# EasyEDA Pro project Restaurant table pager circular.epro, schematic Schematic4
Board Name: Board4; Create Date: 2025-12-18; Page Name: P1; Project Name: Restaurant Table Pager Circular; Schematic Name: Schematic4; Update Date: 2026-02-03; Company: EasyEDA.com; Page Size: A4; Version: V1.0
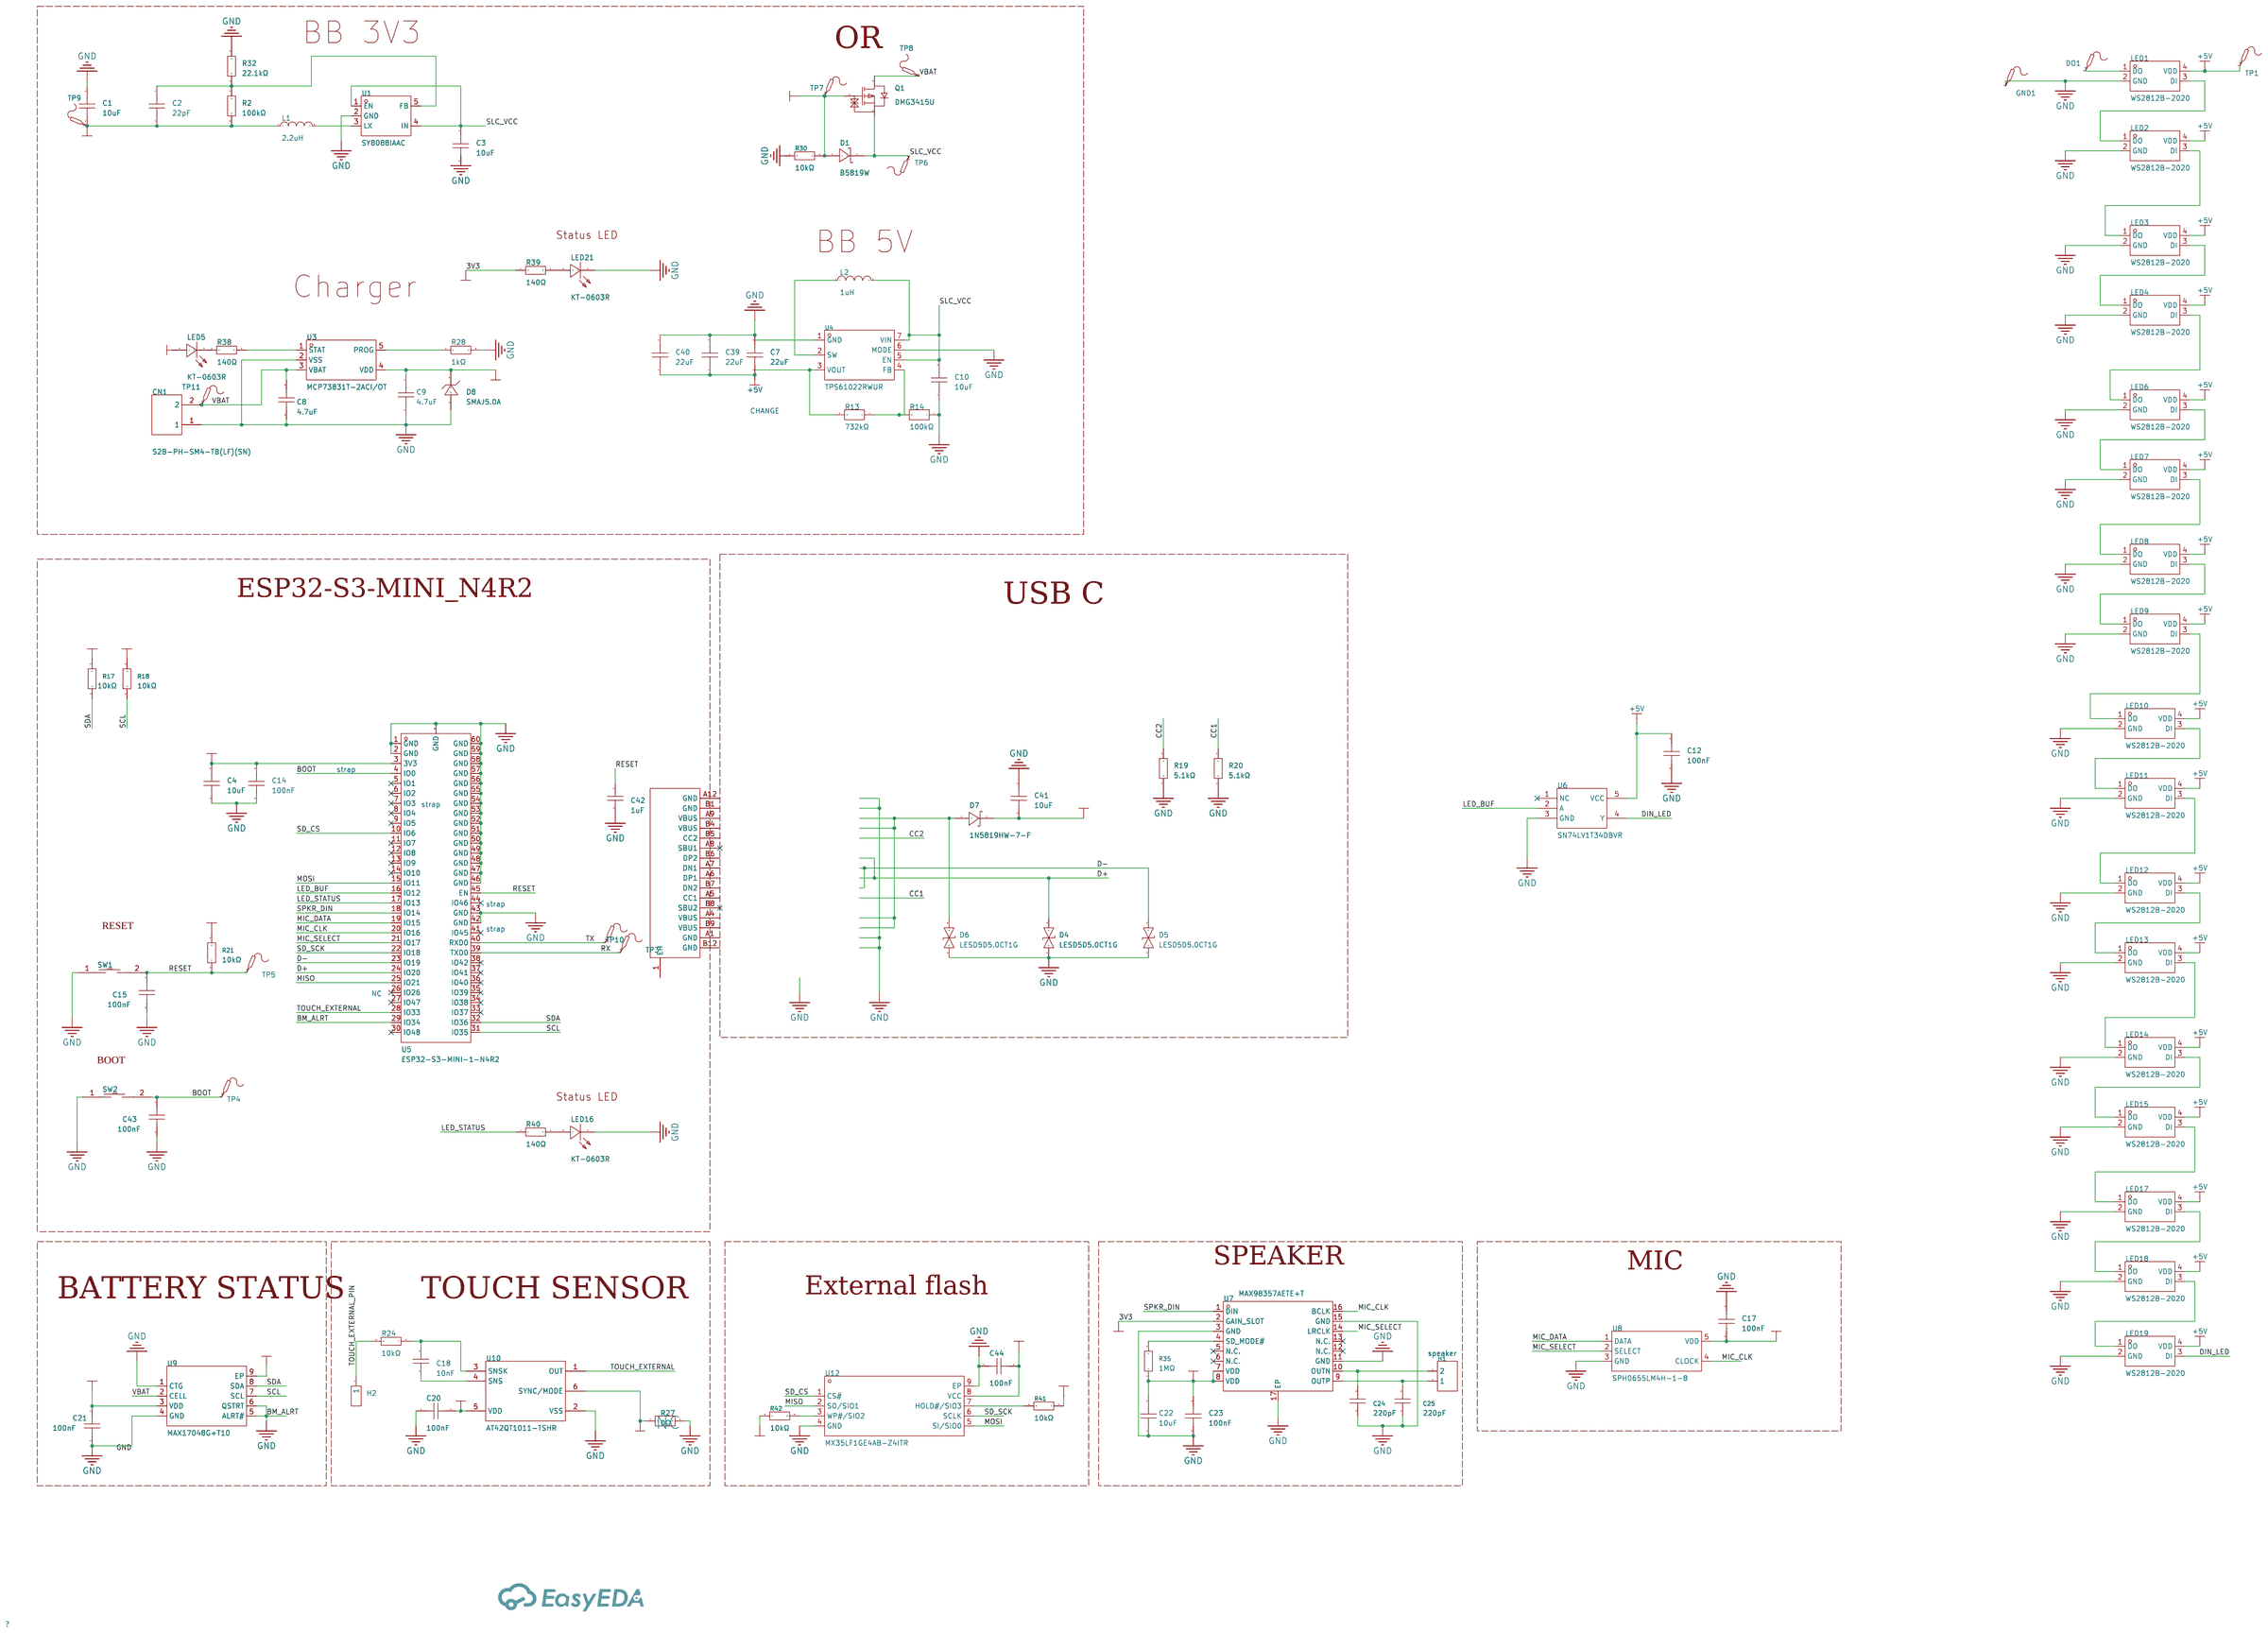
[diagram p0: schematic sheet]

## Parts
C1  10uF  [CAP-SMD_L3.2-W1.6]
C2  22pF  [C0603]
C3  10uF  [CAP-SMD_L3.2-W1.6]
C4  10uF  [C0402]
C7  22uF  [C0402]
C8  4.7uF  [C0402]
C9  4.7uF  [C0402]
C10  10uF  [C0402]
C12  100nF  [C0402]
C14  100nF  [C0402]
C15  100nF  [C0402]
C17  100nF  [C0402]
C18  10nF  [C0402]
C20  100nF  [C0402]
C21  100nF  [C0402]
C22  10uF  [C0402]
C23  100nF  [C0402]
C24  220pF  [C0402]
C25  220pF  [C0402]
C39  22uF  [C0402]
C40  22uF  [C0402]
C41  10uF  [C0402]
C42  1uF  [C0402]
C43  100nF  [C0402]
C44  100nF  [C0402]
CN1  S2B-PH-SM4-TB(LF)(SN)  [CONN-SMD_P2.00_S2B-PH-SM4-TB-LF-SN]
D1  B5819W  [SOD-123_L2.8-W1.8-LS3.7-RD]
D4  LESD5D5.0CT1G  [SOD-523_L1.2-W0.8-LS1.6-BI]
D5  LESD5D5.0CT1G  [SOD-523_L1.2-W0.8-LS1.6-BI]
D6  LESD5D5.0CT1G  [SOD-523_L1.2-W0.8-LS1.6-BI]
D7  1N5819HW-7-F  [SOD-123_L2.7-W1.6-LS3.7-RD]
D8  SMAJ5.0A  [SMA_L4.3-W2.6-LS5.1-RD]
DO1  -  [Test-Point-0.5mm]
GND1  -  [Test-Point-0.5mm]
H1  speaker  [CONN-SMD_P2.00_S2B-PH-SM4-TB-LF-SN]
H2  -  [HDR-TH_1P-V-M_XKB_X4611WV-01I-C28D40]  (no BOM)
L1  2.2uH  [IND-SMD_L2.5-W2.0_MHCHL2520]
L2  1uH  [IND-SMD_L5.4-W5.1]
LED1  WS2812B-2020  [LED-SMD_4P-L2.0-W2.0-TL_WS2812B-2020]
LED2  WS2812B-2020  [LED-SMD_4P-L2.0-W2.0-TL_WS2812B-2020]
LED3  WS2812B-2020  [LED-SMD_4P-L2.0-W2.0-TL_WS2812B-2020]
LED4  WS2812B-2020  [LED-SMD_4P-L2.0-W2.0-TL_WS2812B-2020]
LED5  KT-0603R  [LED0603-RD]
LED6  WS2812B-2020  [LED-SMD_4P-L2.0-W2.0-TL_WS2812B-2020]
LED7  WS2812B-2020  [LED-SMD_4P-L2.0-W2.0-TL_WS2812B-2020]
LED8  WS2812B-2020  [LED-SMD_4P-L2.0-W2.0-TL_WS2812B-2020]
LED9  WS2812B-2020  [LED-SMD_4P-L2.0-W2.0-TL_WS2812B-2020]
LED10  WS2812B-2020  [LED-SMD_4P-L2.0-W2.0-TL_WS2812B-2020]
LED11  WS2812B-2020  [LED-SMD_4P-L2.0-W2.0-TL_WS2812B-2020]
LED12  WS2812B-2020  [LED-SMD_4P-L2.0-W2.0-TL_WS2812B-2020]
LED13  WS2812B-2020  [LED-SMD_4P-L2.0-W2.0-TL_WS2812B-2020]
LED14  WS2812B-2020  [LED-SMD_4P-L2.0-W2.0-TL_WS2812B-2020]
LED15  WS2812B-2020  [LED-SMD_4P-L2.0-W2.0-TL_WS2812B-2020]
LED16  KT-0603R  [LED0603-RD]
LED17  WS2812B-2020  [LED-SMD_4P-L2.0-W2.0-TL_WS2812B-2020]
LED18  WS2812B-2020  [LED-SMD_4P-L2.0-W2.0-TL_WS2812B-2020]
LED19  WS2812B-2020  [LED-SMD_4P-L2.0-W2.0-TL_WS2812B-2020]
LED21  KT-0603R  [LED0603-RD]
Q1  DMG3415U  [SOT-23-3_L2.9-W1.3-P1.90-LS2.4-BR-1]
R2  100kΩ  [R0402]
R13  732kΩ  [R0402]
R14  100kΩ  [R0402]
R17  10kΩ  [R0402]
R18  10kΩ  [R0402]
R19  5.1kΩ  [R0402]
R20  5.1kΩ  [R0402]
R21  10kΩ  [R0402]
R24  10kΩ  [R0402]
R27  0Ω  [R0402]
R28  1kΩ  [R0402]
R30  10kΩ  [R0402]
R32  22.1kΩ  [R0402]
R35  1MΩ  [R0402]
R38  140Ω  [R0402]
R39  140Ω  [R0402]
R40  140Ω  [R0402]
R41  10kΩ  [R0402]
R42  10kΩ  [R0402]
SW1  B3U-1000P  [KEY-SMD_B3U-1000PM]
SW2  B3U-1000P  [KEY-SMD_B3U-1000PM]
TP1  -  [Test-Point-0.5mm]
TP3  -  [Test-Point-0.5mm]
TP4  -  [Test-Point-0.5mm]
TP5  -  [Test-Point-0.5mm]
TP6  -  [Test-Point-0.5mm]
TP7  -  [Test-Point-0.5mm]
TP8  -  [Test-Point-0.5mm]
TP9  -  [Test-Point-0.5mm]
TP10  -  [Test-Point-0.5mm]
TP11  -  [Test-Point-0.5mm]
U1  SY8088IAAC  [SOT-23-5_L3.0-W1.7-P0.95-LS2.8-BL]
U3  MCP73831T-2ACI/OT  [SOT-23-5_L3.0-W1.7-P0.95-LS2.8-BL]
U4  TPS61022RWUR  [VQFN-7_L2.0-W2.0-P0.55-TL_RWU]
U5  ESP32-S3-MINI-1-N4R2  [BULETM-SMD_ESP32-S3-MINI-1-N8]
U6  SN74LV1T34DBVR  [SOT-23-5_L2.9-W1.6-P0.95-LS2.8-BR_2]
U7  MAX98357AETE+T  [TQFN-16_L3.0-W3.0-P0.50-BL-EP1.5]
U8  SPH0655LM4H-1-8  [MIC-SMD_SPH0655LM4H-1-8]
U9  MAX17048G+T10  [TDFN-8_L2.0-W2.0-P0.50-BL-EP1.2]
U10  AT42QT1011-TSHR  [SOT-23-6_L2.9-W1.6-P0.95-LS2.8-BR]
U12  MX35LF1GE4AB-Z4ITR  [WSON-8_L8.0-W6.0-P1.27-TL-1]
USB1  USB4105-GF-A  [TYPE-C-SMD_SBC-160S1A-20-S412]

## Library data of the parts
C1 C3 = CA45-A-16V-10uF-K_C185774: Capacitance:10uF Tolerance:±10% Tolerance:±10% Voltage Rating:16V Equivalent Series Resistance(ESR):2Ω@100kHz Operating Temperature:-55℃~+125℃ Operating Temperature:-55℃~+125℃; LCSC Part Name: 10uF ±10% 16V; Supplier Part: C185774; Manufacturer: TORCH(火炬); Manufacturer Part: CA45-A-16V-10uF-K; Supplier Footprint: CASE-A-3216-16(mm); JLCPCB Part Class: Extended Part; Datasheet: https://item.szlcsc.com/datasheet/CA45-A-16V-10uF-K/197179.html; Supplier: LCSC; Tolerance: ±10%; Voltage Rating: 16V; Equivalent Series Resistance(ESR): 2Ω@100kHz; Operating Temperature: -55℃~+125℃
C2 = AC0603JRNPO9BN220: Capacitance: Tolerance:±5% Tolerance:±5% Voltage Rated: Temperature Coefficient:; LCSC Part Name: 22pF ±5% 50V; Supplier Part: C309441; Manufacturer: YAGEO(国巨); Supplier Footprint: 0603; JLCPCB Part Class: Extended Part; Datasheet: https://atta.szlcsc.com/upload/public/pdf/source/20181008/C309442_A87E4BF7F83363A5173AA98FD3D817F0.pdf; Supplier: LCSC; Tolerance: ±5%
C4 C10 C22 C41 = 0402ZD106MAT2A: Capacitance:10uF Tolerance:±20% Tolerance:±20% Voltage Rating:10V Temperature Coefficient:X5R; LCSC Part Name: 10uF ±20% 10V; Supplier Part: C2167902; Manufacturer: Kyocera AVX; Supplier Footprint: 0402; JLCPCB Part Class: Extended Part; Supplier: LCSC; Tolerance: ±20%; Voltage Rating: 10V; Temperature Coefficient: X5R
C7 C39 C40 = 04026D226MAT2A: Capacitance:22uF Tolerance:±20% Tolerance:±20% Voltage Rating:6.3V Temperature Coefficient:X5R; LCSC Part Name: 22uF ±20% 6.3V; Supplier Part: C2179118; Manufacturer: Kyocera AVX; Supplier Footprint: 0402; JLCPCB Part Class: Extended Part; Supplier: LCSC; Tolerance: ±20%; Voltage Rating: 6.3V; Temperature Coefficient: X5R
C8 C9 = 0402X475K100NT: Capacitance:4.7uF Tolerance:±10% Tolerance:±10% Voltage Rating:10V Temperature Coefficient:X5R; LCSC Part Name: 4.7uF ±10% 10V; Supplier Part: C191541; Manufacturer: FH(风华); Supplier Footprint: 0402; JLCPCB Part Class: Extended Part; Datasheet: https://atta.szlcsc.com/upload/public/pdf/source/20231013/50987BFA113EBC42343E989A0A057269.pdf; Supplier: LCSC; Tolerance: ±10%; Voltage Rating: 10V; Temperature Coefficient: X5R
C12 = CL05B104KO5NNNC: Capacitance:100nF Tolerance:±10% Tolerance:±10% Voltage Rating:16V Temperature Coefficient:X7R; LCSC Part Name: 100nF ±10% 16V; Supplier Part: C1525; Manufacturer: SAMSUNG(三星); Supplier Footprint: 0402; JLCPCB Part Class: Basic Part; Datasheet: https://item.szlcsc.com/datasheet/CL05B104KO5NNNC/1877.html; Supplier: LCSC; Tolerance: ±10%; Voltage Rating: 16V; Temperature Coefficient: X7R
C14 C15 C20 C21 C23 C43 = CL05B104KB54PNC: Capacitance:100nF Tolerance:±10% Tolerance:±10% Voltage Rating:50V Temperature Coefficient:X7R; LCSC Part Name: 100nF ±10% 50V; Supplier Part: C307331; Manufacturer: SAMSUNG(三星); Supplier Footprint: 0402; JLCPCB Part Class: Basic Part; Datasheet: https://item.szlcsc.com/datasheet/CL05B104KB54PNC/291005.html; Supplier: LCSC; Tolerance: ±10%; Voltage Rating: 50V; Temperature Coefficient: X7R
C17 C44 = CT41G-0402-2X1-16V-0.1uF-K(N): Capacitance:100nF Tolerance:±10% Tolerance:±10% Voltage Rating:16V Temperature Coefficient:-; LCSC Part Name: 100nF ±10% 16V; Supplier Part: C141382; Manufacturer: TORCH(火炬); Supplier Footprint: 0402; JLCPCB Part Class: Extended Part; Datasheet: https://item.szlcsc.com/datasheet/CT41G-0402-2X1-16V-0.1uF-K(N)/152712.html; Supplier: LCSC; Tolerance: ±10%; Voltage Rating: 16V
C18 = CL05B103KB5NNNC: Capacitance: Tolerance:±10% Tolerance:±10% Voltage Rated: Temperature Coefficient:; LCSC Part Name: 10nF ±10% 50V; Supplier Part: C15195; Manufacturer: SAMSUNG(三星); Supplier Footprint: 0402; JLCPCB Part Class: Basic Part; Datasheet: https://atta.szlcsc.com/upload/public/pdf/source/20160218/1457707763339.pdf; Supplier: LCSC; Tolerance: ±10%
C24 C25 = 0402N221G500CT: Capacitance: Tolerance:±2% Tolerance:±2% Voltage Rated: Temperature Coefficient:; LCSC Part Name: 220pF ±2% 50V; Supplier Part: C458858; Manufacturer: Walsin(华新科); Supplier Footprint: 0402; JLCPCB Part Class: Extended Part; Datasheet: https://atta.szlcsc.com/upload/public/pdf/source/20191217/C469650_84AD5C6F618CF4AC0C6D987F2E8FE6F8.pdf; Supplier: LCSC; Tolerance: ±2%
C42 = CL05A105KP5NNNC: Capacitance:1uF Tolerance:±10% Tolerance:±10% Voltage Rating:10V Temperature Coefficient:X5R; LCSC Part Name: 1uF ±10% 10V; Supplier Part: C14445; Manufacturer: SAMSUNG(三星); Supplier Footprint: 0402; JLCPCB Part Class: Extended Part; Datasheet: https://item.szlcsc.com/datasheet/CL05A105KP5NNNC/15107.html; Supplier: LCSC; Tolerance: ±10%; Voltage Rating: 10V; Temperature Coefficient: X5R
CN1 H1 = S2B-PH-SM4-TB(LF)(SN): Pins Structure:1x2P Pitch:2mm Mounting Style:Horizontal attachment Reference Series:PH Number of Pins:2P Number of Rows:1 Number of PINs Per Row:2 Row Spacing:- Current Rating (Max):2A Contact Material:Copper alloy Contact Plating:Tin Operating Temperatur; LCSC Part Name: 1x2P 间距:2mm 卧贴 系列:PH; Supplier Part: C295747; Manufacturer: JST; Supplier Footprint: SMD,P=2mm,卧贴; JLCPCB Part Class: Extended Part; Datasheet: https://atta.szlcsc.com/upload/public/pdf/source/20210203/C295747_344B2E64535E381E727D98C302AB61C7.pdf; Supplier: LCSC; Pins Structure: 1x2P; Pitch: 2mm; Mounting Style: Horizontal attachment; Reference Series: PH; Number of Pins: 2P; Number of Rows: 1; Number of PINs Per Row: 2; Current Rating (Max): 2A; Contact Material: Copper alloy; Contact Plating: Tin; Operating Temperature Range: -25℃~+85℃; Rated Voltage (Max): 100V; Plastic Material: PA; Flame Retardant Rating: UL94V-0; Supplementary Features: Auxiliary soldering legs; Colour: Beige; Z-Height of the Board: 5.5mm; X-Length of Bottom Edge on Board (Spacing Line): 7.9mm; Y-Width of Bottom Edge on Board: 8.6mm
D1 = B5819W_C64885: Diode Configuration:Independent Voltage - Forward(Vf@If):900mV@3A Voltage - DC Reverse(Vr):40V Current - Rectified:1A Reverse Leakage Current (Ir):1mA@40V Operating Junction Temperature Range:-55℃~+125℃ Operating Junction Temperature Range:-55℃~+125℃ Non-; LCSC Part Name: 丝印SL 电压:40V 电流:1A; Supplier Part: C64885; Manufacturer: MDD(辰达半导体); Supplier Footprint: SOD-123; JLCPCB Part Class: Extended Part; Datasheet: https://item.szlcsc.com/datasheet/B5819W/65955.html; Supplier: LCSC; Diode Configuration: Independent; Voltage - Forward(Vf@If): 900mV@3A; Voltage - DC Reverse(Vr): 40V; Current - Rectified: 1A; Reverse Leakage Current (Ir): 1mA@40V; Operating Junction Temperature Range: -55℃~+125℃; Non-Repetitive Peak Forward Surge Current: 25A
D4-D6 = LESD5D5.0CT1G_C41399463: Polarity:Bidirectional Reverse Stand-Off Voltage (Vrwm):5V Clamping Voltage:16V Peak Pulse Current (Ipp):7A Peak Pulse Power Dissipation (Ppp):100W Voltage - Breakdown:7V Reverse Leakage Current (Ir):1uA Operating Temperature:-55℃~+150℃@(Tj) Operating Tem; LCSC Part Name: 双向ESD 5V截止 峰值脉冲电流：7A; Supplier Part: C41399463; Manufacturer: GOODWORK(固得沃克); Supplier Footprint: SOD-523; JLCPCB Part Class: Extended Part; Datasheet: https://item.szlcsc.com/datasheet/LESD5D5.0CT1G/43196790.html; Supplier: LCSC; Polarity: Bidirectional; Reverse Stand-Off Voltage (Vrwm): 5V; Clamping Voltage: 16V; Peak Pulse Current (Ipp): 7A; Peak Pulse Power Dissipation (Ppp): 100W; Voltage - Breakdown: 7V; Reverse Leakage Current (Ir): 1uA; Operating Temperature: -55℃~+150℃@(Tj); level of protection: IEC 61000-4-2; Type: ESD; Junction Capacitance: 12pF
D7 = 1N5819HW-7-F: Diode Configuration:1 Independent Voltage - Forward(Vf@If):450mV@1A Voltage - DC Reverse(Vr):40V Current - Rectified:1A Reverse Leakage Current (Ir):1mA@40V Operating Junction Temperature Range:-65℃~+150℃ Operating Junction Temperature Range:-65℃~+150℃ No; LCSC Part Name: 电压:40V 电流:1A; Supplier Part: C82544; Manufacturer: DIODES(美台); Supplier Footprint: SOD-123; JLCPCB Part Class: Extended Part; Datasheet: https://item.szlcsc.com/datasheet/1N5819HW-7-F/83701.html; Supplier: LCSC; Diode Configuration: 1 Independent; Voltage - Forward(Vf@If): 450mV@1A; Voltage - DC Reverse(Vr): 40V; Current - Rectified: 1A; Reverse Leakage Current (Ir): 1mA@40V; Operating Junction Temperature Range: -65℃~+150℃; Non-Repetitive Peak Forward Surge Current: 25A
D8 = SMAJ5.0A_C5249616: Polarity:Unidirectional Reverse Stand-Off Voltage (Vrwm):5V Clamping Voltage:9.2V Peak Pulse Current (Ipp):43.5A Peak Pulse Power Dissipation (Ppp):400W Voltage - Breakdown:6.4V Reverse Leakage Current (Ir):400uA Number of Channels:1.0 Operating Temperatu; LCSC Part Name: 单向TVS 5V截止; Supplier Part: C5249616; Manufacturer: ElecSuper(静芯); Supplier Footprint: SMA(DO-214AC); JLCPCB Part Class: Extended Part; Datasheet: https://item.szlcsc.com/datasheet/SMAJ5.0A/5963162.html; Supplier: LCSC; Polarity: Unidirectional; Reverse Stand-Off Voltage (Vrwm): 5V; Clamping Voltage: 9.2V; Peak Pulse Current (Ipp): 43.5A; Peak Pulse Power Dissipation (Ppp): 400W; Voltage - Breakdown: 6.4V; Reverse Leakage Current (Ir): 400uA; Number of Channels: 1.0; Operating Temperature: -65℃~+150℃; level of protection: IEC 61000-4-2; Type: TVS
DO1 GND1 TP1 TP3-TP11 = Test-Point: Test Point 测试点
H2 = HDR-M_2.54_1x1P: Supplier Footprint: Through; Check: false
L1 = FTC252012S2R2MBCA: Inductance: Tolerance:±20% Tolerance:±20% Rated Current:3A Saturation Current (Isat):3.8A DC Resistance (DCR): Type:一体成型电感; LCSC Part Name: 2.2uH ±20% 3.8A; Supplier Part: C5832372; Manufacturer: cjiang(长江微电); Supplier Footprint: 1008; JLCPCB Part Class: Extended Part; Datasheet: https://atta.szlcsc.com/upload/public/pdf/source/20230602/8FFEDA9C0247A92A0D4B67554BFE4091.pdf; Supplier: LCSC; Tolerance: ±20%; Rated Current: 3A; Saturation Current (Isat): 3.8A; Type: 一体成型电感
L2 = SLO0520H1R0MTT: Inductance:1uH Tolerance:±20% Tolerance:±20% Current Rating:5A DC Resistance(DCR):15mΩ; LCSC Part Name: 1uH ±20%; Supplier Part: C325980; Manufacturer: Sunltech(顺磁); Supplier Footprint: SMD,5.4x5.1mm; JLCPCB Part Class: Extended Part; Datasheet: https://item.szlcsc.com/datasheet/SLO0520H1R0MTT/306197.html; Supplier: LCSC; Tolerance: ±20%; Current Rating: 5A; DC Resistance(DCR): 15mΩ
LED1-LED4 LED6-LED15 LED17-LED19 = WS2812B-2020: Wavelength:515.6nm；622.5nm；470.4nm Luminous Intensity:200mcd；160mcd；520mcd Fixed-Frequency Pwm Mode:- Data Transmission Rate:100KB/S Voltage - Supply:5V Voltage - Supply:5V Quiescent Current:- Lens Color:- ESD Withstand Voltage:- Installation method:op Vi; LCSC Part Name: RGB三色; Supplier Part: C965555; Manufacturer: worldsemi; Supplier Footprint: SMD,2.2x2mm; JLCPCB Part Class: Extended Part; Datasheet: https://item.szlcsc.com/datasheet/WS2812B-2020/1051115.html; Supplier: LCSC; Wavelength: 515.6nm；622.5nm；470.4nm; Luminous Intensity: 200mcd；160mcd；520mcd; Data Transmission Rate: 100KB/S; Voltage - Supply: 5V; Installation method: op View Mount
LED5 LED16 LED21 = KT-0603R: Emitted Color:Red Power Dissipation:- Forward Current:- Dominant Wavelength:- Dominant Wavelength:- Peak Wavelength:- Diode Configuration:- Lens Color:- Color Temperature:- Color Temperature:- Viewing Angle:- Mounting Sytle:- Operating Temperature:-40℃~+8; LCSC Part Name: 0603 红灯 高亮; Supplier Part: C2286; Manufacturer: KENTO; Supplier Footprint: 0603; JLCPCB Part Class: Basic Part; Datasheet: https://atta.szlcsc.com/upload/public/pdf/source/20160616/1466072038404.pdf; Supplier: LCSC; Emitted Color: Red; Operating Temperature: -40℃~+85℃
Q1 = DMG3415U: Drain to Source Voltage:20V Current - Continuous Drain(Id): RDS(on):49mΩ@2.5V,4A Pd - Power Dissipation:1.4W Gate Threshold Voltage (Vgs(th)@Id):350mV Gate Charge(Qg):- Input Capacitance(Ciss@Vds):1181.1pF@10V Reverse Transfer Capacitance (Crss@Vds):114.8; LCSC Part Name: 耐压:20V 电流:4A; Supplier Part: C7202986; Manufacturer: TECH PUBLIC(台舟); Supplier Footprint: SOT-23; JLCPCB Part Class: Extended Part; Datasheet: https://atta.szlcsc.com/upload/public/pdf/source/20230529/58554909FE09FF38B9F41498AE71FCE8.pdf; Supplier: LCSC; Drain to Source Voltage: 20V; RDS(on): 49mΩ@2.5V,4A; Pd - Power Dissipation: 1.4W; Gate Threshold Voltage (Vgs(th)@Id): 350mV; Input Capacitance(Ciss@Vds): 1181.1pF@10V; Reverse Transfer Capacitance (Crss@Vds): 114.8pF; Operating Temperature: -55℃~+150℃
R2 = RC0402FR-07100KL: Type:Thick Film Resistor Resistance:100kΩ Tolerance:±1% Tolerance:±1% Power(Watts):62.5mW Voltage-Supply(Max):50V Temperature Coefficient:±100ppm/℃ Temperature Coefficient:±100ppm/℃ Operating Temperature:-55℃~+155℃ Operating Temperature:-55℃~+155℃; LCSC Part Name: 厚膜电阻 100kΩ ±1% 62.5mW; Supplier Part: C60491; Manufacturer: YAGEO(国巨); Supplier Footprint: 0402; JLCPCB Part Class: Extended Part; Datasheet: https://atta.szlcsc.com/upload/public/pdf/source/20250610/89E4D743C004A82A45145C7A2CC3A578.pdf; Supplier: LCSC; Type: Thick Film Resistor; Tolerance: ±1%; Power(Watts): 62.5mW; Voltage-Supply(Max): 50V; Temperature Coefficient: ±100ppm/℃; Operating Temperature: -55℃~+155℃
R13 = AC0402FR-07732KL: Type:Thick Film Resistor Resistance:732kΩ Tolerance:±1% Tolerance:±1% Power(Watts):62.5mW Voltage-Supply(Max):50V Temperature Coefficient:±100ppm/℃ Temperature Coefficient:±100ppm/℃ Operating Temperature:-55℃~+155℃ Operating Temperature:-55℃~+155℃; LCSC Part Name: 厚膜电阻 732kΩ ±1% 62.5mW; Supplier Part: C227216; Manufacturer: YAGEO(国巨); Supplier Footprint: 0402; JLCPCB Part Class: Extended Part; Datasheet: https://atta.szlcsc.com/upload/public/pdf/source/20241120/4D446B3946E6DC27047BD586A1D384B4.pdf; Supplier: LCSC; Type: Thick Film Resistor; Tolerance: ±1%; Power(Watts): 62.5mW; Voltage-Supply(Max): 50V; Temperature Coefficient: ±100ppm/℃; Operating Temperature: -55℃~+155℃
R14 = CRCW0402100KFKED: Type:Thick Film Resistors Resistance:100kΩ Tolerance:±1% Tolerance:±1% Power(Watts):63mW Voltage-Supply(Max):75V Temperature Coefficient:±100ppm/℃ Temperature Coefficient:±100ppm/℃ Operating Temperature:-55℃~+155℃ Operating Temperature:-55℃~+155℃; LCSC Part Name: 厚膜电阻 100kΩ ±1% 63mW; Supplier Part: C481918; Manufacturer: VISHAY(威世); Supplier Footprint: 0402; JLCPCB Part Class: Extended Part; Datasheet: https://item.szlcsc.com/datasheet/CRCW0402100KFKED/489944.html; Supplier: LCSC; Type: Thick Film Resistors; Tolerance: ±1%; Power(Watts): 63mW; Voltage-Supply(Max): 75V; Temperature Coefficient: ±100ppm/℃; Operating Temperature: -55℃~+155℃
R17 R18 R21 R30 R41 R42 = 0402WGJ0103TCE: Type:Thick Film Resistors Resistance:10kΩ Tolerance:±5% Tolerance:±5% Power(Watts): Overload Voltage (Max): Temperature Coefficient:±100ppm/℃ Temperature Coefficient:±100ppm/℃ Operating Temperature Range:-55℃~+155℃ Operating Temperature Range:-55℃~+155℃; LCSC Part Name: 10kΩ ±5% 62.5mW 厚膜电阻; Supplier Part: C25531; Manufacturer: UNI-ROYAL(厚声); Supplier Footprint: 0402; JLCPCB Part Class: Extended Part; Datasheet: https://atta.szlcsc.com/upload/public/pdf/source/20200306/C422600_1E6D84923E4A46A82E41ADD87F860B5C.pdf; Supplier: LCSC; Type: Thick Film Resistors; Tolerance: ±5%; Temperature Coefficient: ±100ppm/℃; Operating Temperature Range: -55℃~+155℃
R19 R20 = RMC04025.1K5%N: Type:Thick Film Resistor Resistance:5.1kΩ Tolerance:±5% Tolerance:±5% Power(Watts):62.5mW Voltage-Supply(Max):50V Temperature Coefficient:±100ppm/℃ Temperature Coefficient:±100ppm/℃ Operating Temperature:-55℃~+155℃ Operating Temperature:-55℃~+155℃; LCSC Part Name: 厚膜电阻 5.1kΩ ±5% 62.5mW; Supplier Part: C325524; Manufacturer: Tyohm(幸亚电阻); Supplier Footprint: 0402; JLCPCB Part Class: Extended Part; Datasheet: https://item.szlcsc.com/datasheet/RMC04025.1K5%2525N/305729.html; Supplier: LCSC; Type: Thick Film Resistor; Tolerance: ±5%; Power(Watts): 62.5mW; Voltage-Supply(Max): 50V; Temperature Coefficient: ±100ppm/℃; Operating Temperature: -55℃~+155℃
R24 = SCR0402F10K: Type:Thick Film Resistor Resistance:10kΩ Tolerance:±1% Tolerance:±1% Power(Watts):62.5mW Voltage-Supply(Max):50V Operating Temperature:-55℃~+155℃ Operating Temperature:-55℃~+155℃; LCSC Part Name: 厚膜电阻 10kΩ ±1% 62.5mW; Supplier Part: C3015825; Manufacturer: VO(翔胜); Supplier Footprint: 0402; JLCPCB Part Class: Extended Part; Datasheet: https://atta.szlcsc.com/upload/public/pdf/source/20220513/247AF9639BA21CF93567DC289CCC6A22.pdf; Supplier: LCSC; Type: Thick Film Resistor; Tolerance: ±1%; Power(Watts): 62.5mW; Voltage-Supply(Max): 50V; Operating Temperature: -55℃~+155℃
R27 = SCR0402J0R: Type:Thick Film Resistor Resistance:0Ω Tolerance:±5% Tolerance:±5% Power(Watts):62.5mW Voltage-Supply(Max):50V Operating Temperature:-55℃~+155℃ Operating Temperature:-55℃~+155℃; LCSC Part Name: 厚膜电阻 0Ω ±5% 62.5mW; Supplier Part: C3017451; Manufacturer: VO(翔胜); Supplier Footprint: 0402; JLCPCB Part Class: Extended Part; Datasheet: https://atta.szlcsc.com/upload/public/pdf/source/20220513/247AF9639BA21CF93567DC289CCC6A22.pdf; Supplier: LCSC; Type: Thick Film Resistor; Tolerance: ±5%; Power(Watts): 62.5mW; Voltage-Supply(Max): 50V; Operating Temperature: -55℃~+155℃
R28 = RC0402FR-071KL: Type:Thick Film Resistors Resistance: Tolerance:±1% Tolerance:±1% Power(Watts): Overload Voltage (Max): Temperature Coefficient:±100ppm/℃ Temperature Coefficient:±100ppm/℃ Operating Temperature Range:-55℃~+155℃ Operating Temperature Range:-55℃~+155℃; LCSC Part Name: 厚膜电阻 1kΩ ±1% 62.5mW; Supplier Part: C106235; Manufacturer: YAGEO(国巨); Supplier Footprint: 0402; JLCPCB Part Class: Extended Part; Datasheet: https://atta.szlcsc.com/upload/public/pdf/source/20180927/C295883_E8D83085EA81BD7DE0B2B681138C15EE.pdf; Supplier: LCSC; Type: Thick Film Resistors; Tolerance: ±1%; Temperature Coefficient: ±100ppm/℃; Operating Temperature Range: -55℃~+155℃
R32 = RC0402FR-0722K1L: Type:Thick Film Resistor Resistance:22.1kΩ Tolerance:±1% Tolerance:±1% Power(Watts):62.5mW Voltage-Supply(Max):50V Temperature Coefficient:±100ppm/℃ Temperature Coefficient:±100ppm/℃ Operating Temperature:-55℃~+155℃ Operating Temperature:-55℃~+155℃; LCSC Part Name: 厚膜电阻 22.1kΩ ±1% 62.5mW; Supplier Part: C163478; Manufacturer: YAGEO(国巨); Supplier Footprint: 0402; JLCPCB Part Class: Extended Part; Datasheet: https://item.szlcsc.com/datasheet/RC0402FR-0722K1L/174859.html; Supplier: LCSC; Type: Thick Film Resistor; Tolerance: ±1%; Power(Watts): 62.5mW; Voltage-Supply(Max): 50V; Temperature Coefficient: ±100ppm/℃; Operating Temperature: -55℃~+155℃
R35 = 0402WGF1004TCE: Type:Thick Film Resistor Resistance:1MΩ Tolerance:±1% Tolerance:±1% Power(Watts):62.5mW Voltage-Supply(Max):50V Temperature Coefficient:±100ppm/℃ Temperature Coefficient:±100ppm/℃ Operating Temperature:-55℃~+155℃ Operating Temperature:-55℃~+155℃; LCSC Part Name: 1MΩ ±1% 62.5mW 厚膜电阻; Supplier Part: C26083; Manufacturer: UNI-ROYAL(厚声); Supplier Footprint: 0402; JLCPCB Part Class: Basic Part; Datasheet: https://item.szlcsc.com/datasheet/0402WGF1004TCE/26826.html; Supplier: LCSC; Type: Thick Film Resistor; Tolerance: ±1%; Power(Watts): 62.5mW; Voltage-Supply(Max): 50V; Temperature Coefficient: ±100ppm/℃; Operating Temperature: -55℃~+155℃
R38-R40 = RT0402FRE07140RL: Type:Thin Film Resistor Resistance: Tolerance:±1% Tolerance:±1% Power(Watts): Overload Voltage (Max): Temperature Coefficient:±50ppm/℃ Temperature Coefficient:±50ppm/℃ Operating Temperature Range:-55℃~+155℃ Operating Temperature Range:-55℃~+155℃; LCSC Part Name: 薄膜电阻 140Ω ±1% 62.5mW; Supplier Part: C327016; Manufacturer: YAGEO(国巨); Supplier Footprint: 0402; JLCPCB Part Class: Extended Part; Datasheet: https://atta.szlcsc.com/upload/public/pdf/source/20181031/C327016_98A2DCD6CD66629A27FEF62E41849CF7.pdf; Supplier: LCSC; Type: Thin Film Resistor; Tolerance: ±1%; Temperature Coefficient: ±50ppm/℃; Operating Temperature Range: -55℃~+155℃
SW1 SW2 = B3U-1000P_C231329: Circuit:SPST Actuator Style:Round Button Operating Force:1.53N Mounting Type:Surface Mount,Vertical Length:3mm Width:2.5mm Switch Height:1.6mm Contact Current:50mA Voltage Rating:12V With Lamp:- Termination Style:SMD(SMT) Tab Life:- Operating Temperature:; LCSC Part Name: 3*2.5*1.6mm 立贴 轻触开关; Supplier Part: C231329; Manufacturer: OMRON(欧姆龙); Supplier Footprint: SMD,2.5x3mm; JLCPCB Part Class: Extended Part; Datasheet: https://item.szlcsc.com/datasheet/B3U-1000P/231216.html; Supplier: LCSC; Circuit: SPST; Actuator Style: Round Button; Operating Force: 1.53N; Mounting Type: Surface Mount,Vertical; Length: 3mm; Width: 2.5mm; Switch Height: 1.6mm; Contact Current: 50mA; Voltage Rating: 12V; Termination Style: SMD(SMT) Tab; Operating Temperature: -25℃~+70℃
U1 = SY8088IAAC: Function:Step-down type Output Type:Fixed Input Voltage:2.5V~5.5V Input Voltage:2.5V~5.5V Output Voltage:1.8V Output Voltage:1.8V Output Current:1A Switching Frequency:1.5MHz Switching Frequency:1.5MHz Operating Temperature:-40℃~+125℃ Operating Temperatur; LCSC Part Name: 高效率1.5MHz 1A同步降压DC/DC调节器; Supplier Part: C479072; Manufacturer: silergy(矽力杰); Supplier Footprint: SOT-23-5; JLCPCB Part Class: Extended Part; Datasheet: https://atta.szlcsc.com/upload/public/pdf/source/20200117/C479072_33DBD93C562E6383E475C3BDEE4B4060.pdf; Supplier: LCSC; Function: Step-down type; Output Type: Fixed; Input Voltage: 2.5V~5.5V; Output Voltage: 1.8V; Output Current: 1A; Switching Frequency: 1.5MHz; Operating Temperature: -40℃~+125℃; Synchronous Rectification: Yes; Number of Outputs: 1; Topology: Step-down; Quiescent Current (Iq): 50uA; Switch tube (built-in/external): Built-in
U3 = MCP73831T-2ACI/OT: The Chip Type:- Voltage - Supply:3.75V~6V Voltage - Supply:3.75V~6V Charge Current - Max:- Charging Saturation Voltage:4.2V Type of Battery:Lithium-ion/Polymer Number of Cells:1 Number of Cells:1 Operating Temperature:-40℃~+85℃ Operating Temperature:-40℃~; Supplier Part: C424093; Manufacturer: MICROCHIP(美国微芯); Supplier Footprint: SOT-23-5; JLCPCB Part Class: Extended Part; Datasheet: https://item.szlcsc.com/datasheet/MCP73831T-2ACI%252FOT/417116.html; Supplier: LCSC; Voltage - Supply: 3.75V~6V; Charging Saturation Voltage: 4.2V; Type of Battery: Lithium-ion/Polymer; Number of Cells: 1; Operating Temperature: -40℃~+85℃
U4 = TPS61022RWUR: Function:Boost Output Type:Adjustable Voltage - Supply:500mV~5.5V Voltage - Supply:500mV~5.5V Output Voltage:2.2V~5.5V Output Voltage:2.2V~5.5V Output Current:- Frequency - Switching:1MHz；600kHz Frequency - Switching:1MHz；600kHz Operating Temperature:-40℃; LCSC Part Name: 具有0.5V超低输入电压的升压转换器; Supplier Part: C915088; Manufacturer: TI(德州仪器); Supplier Footprint: VQFN-7(2x2); JLCPCB Part Class: Extended Part; Datasheet: https://www.ti.com/cn/lit/gpn/tps61022; Supplier: LCSC; Function: Boost; Output Type: Adjustable; Voltage - Supply: 500mV~5.5V; Output Voltage: 2.2V~5.5V; Frequency - Switching: 1MHz；600kHz; Operating Temperature: -40℃~+125℃@(TJ); Synchronous Rectifier: Yes; Number of Outputs: 1; Topology: Boost; Switch tube (built-in/external): Built-In
U5 = ESP32-S3-MINI-1-N4R2: Antenna Type:On-board PCB Antenna; Supplier Part: C3013941; Manufacturer: ESPRESSIF(乐鑫); Supplier Footprint: SMD; JLCPCB Part Class: Extended Part; Datasheet: https://item.szlcsc.com/datasheet/ESP32-S3-MINI-1-N4R2/3522411.html; Supplier: LCSC; Antenna Type: On-board PCB Antenna
U6 = SN74LV1T34DBVR_RF v1.0: Input type:- output type:- Voltage - Supply:1.6V~5.5V Voltage - Supply:1.6V~5.5V Number of Elements:1 Number of Bits per Element:1 Current - Output Low(IOL):8mA Current - Output High(IOH):8mA Logic Family:74LV Operating Temperature:-40℃~+125℃ Operating Te; Supplier Part: C100024; Manufacturer: TI(德州仪器); Supplier Footprint: SOT-23-5; Datasheet: https://www.ti.com/cn/lit/gpn/sn74lv1t34; Supplier: LCSC; Voltage - Supply: 1.6V~5.5V; Number of Elements: 1; Number of Bits per Element: 1; Current - Output Low(IOL): 8mA; Current - Output High(IOH): 8mA; Logic Family: 74LV; Operating Temperature: -40℃~+125℃
U7 = MAX98357AETE+T: Class:Class D Speaker Channels:- Output Power:3.2W×1@4Ω Voltage - Supply:2.5V~5.5V Voltage - Supply:2.5V~5.5V Total Harmonic Distortion + Noise (THD+N):- Quiescent Current:2.4mA Operating Temperature:-40℃~+85℃ Operating Temperature:-40℃~+85℃ Power Supply; LCSC Part Name: 微型、低成本、PCM 类 D 级放大器具有 AB 级性能; Supplier Part: C910544; Manufacturer: ADI(亚德诺)/MAXIM(美信); Supplier Footprint: TQFN-16-EP(3x3); JLCPCB Part Class: Extended Part; Datasheet: https://item.szlcsc.com/datasheet/MAX98357AETE%252BT/978950.html; Supplier: LCSC; Class: Class D; Output Power: 3.2W×1@4Ω; Voltage - Supply: 2.5V~5.5V; Quiescent Current: 2.4mA; Operating Temperature: -40℃~+85℃; Power Supply Rejection Ratio (PSRR): 77dB; Efficiency: 92%
U8 = SPH0655LM4H-1-8: Supplier Part: C22376158; Manufacturer: Knowles(楼氏); Supplier Footprint: SMD; JLCPCB Part Class: Extended Part; Datasheet: https://atta.szlcsc.com/upload/public/pdf/source/20250721/5475C98035E60ADDD1C93C8246A1E933.pdf; Supplier: LCSC
U9 = MAX17048G+T10: The Chip Type:Battery monitoring chip Voltage - Supply:2.5V~4.5V Voltage - Supply:2.5V~4.5V Type of Battery:Lithium-ion/Polymer Number of Cells:1 Number of Cells:1 Operating Temperature:-40℃~+85℃ Operating Temperature:-40℃~+85℃; LCSC Part Name: 单节/双节电池电量计使用ModelGauge技术; Supplier Part: C2682616; Manufacturer: ADI(亚德诺)/MAXIM(美信); Supplier Footprint: DFN-8-EP(2x2); JLCPCB Part Class: Extended Part; Datasheet: https://item.szlcsc.com/datasheet/MAX17048G%252BT10/2777647.html; Supplier: LCSC; The Chip Type: Battery monitoring chip; Voltage - Supply: 2.5V~4.5V; Type of Battery: Lithium-ion/Polymer; Number of Cells: 1; Operating Temperature: -40℃~+85℃
U10 = AT42QT1011-TSHR: Number of Channels:1 Voltage - Supply:1.8V~5.5V Voltage - Supply:1.8V~5.5V Operating Temperature:-40℃~+85℃ Operating Temperature:-40℃~+85℃; Supplier Part: C112956; Manufacturer: MICROCHIP(美国微芯); Supplier Footprint: SOT-23-6; JLCPCB Part Class: Extended Part; Datasheet: https://item.szlcsc.com/datasheet/AT42QT1011-TSHR/114188.html; Supplier: LCSC; The Channel Number: 1; Operating Voltage: 1.8V~5.5V; Operating Temperature: -40℃~+85℃; Number of Channels: 1; Voltage - Supply: 1.8V~5.5V
U12 = MX35LF1GE4AB-Z4ITR: Memory Size:1Gbit Interface:SPI Clock Frequency:104MHz Voltage - Supply:2.7V~3.6V Voltage - Supply:2.7V~3.6V Write Cycle Time(tWC):- Page Program time (TPP):300us Block Erase Time(tBE):1ms Data Retention - TDR (Year):10 Years Operating Temperature:-40℃~+8; LCSC Part Name: 3V、1Gb 串行 NAND 闪存; Supplier Part: C2802769; Manufacturer: MXIC(旺宏电子); Supplier Footprint: WSON-8(6x8); JLCPCB Part Class: Extended Part; Datasheet: https://item.szlcsc.com/datasheet/MX35LF1GE4AB-Z4ITR/2945014.html; Supplier: LCSC; Memory Size: 1Gbit; Interface: SPI; Clock Frequency: 104MHz; Voltage - Supply: 2.7V~3.6V; Page Program time (TPP): 300us; Block Erase Time(tBE): 1ms; Data Retention - TDR (Year): 10 Years; Operating Temperature: -40℃~+85℃; Standby Supply Current: 50uA; Program / Erase Cycles: 100,000 Cycles
USB1 = USB4105-GF-A: Supplier Part: C3020560; Manufacturer: GCT; Supplier Footprint: SMD; Datasheet: https://item.szlcsc.com/datasheet/USB4105-GF-A/3542626.html; Supplier: LCSC

## Nets
3V3: C1.1 C2.2 C4.2 C14.2 C17.2 C20.2 C21.1 C22.2 C23.2 C44.1 L1.1 R2.2 R17.2 R18.2 R21.2 R27.1 R35.1 R39.1 R41.1 R42.1 TP9.1 U5.3(3V3) U7.2(GAIN_SLOT) U7.7(VDD) U7.8(VDD) U8.5(VDD) U9.3(VDD) U9.9(EP) U10.5(VDD) U10.6(SYNC/MODE) U12.8(VCC)
+5V: C7.1 C12.2 C39.1 C40.1 LED1.4(VDD) LED2.4(VDD) LED3.4(VDD) LED4.4(VDD) LED6.4(VDD) LED7.4(VDD) LED8.4(VDD) LED9.4(VDD) LED10.4(VDD) LED11.4(VDD) LED12.4(VDD) LED13.4(VDD) LED14.4(VDD) LED15.4(VDD) LED17.4(VDD) LED18.4(VDD) LED19.4(VDD) R13.2 TP1.1 U4.3(VOUT) U6.5(VCC)
GND: C1.2 C3.2 C4.1 C7.2 C8.2 C9.2 C10.1 C12.1 C14.1 C15.2 C17.1 C20.1 C21.2 C22.1 C23.1 C24.1 C25.1 C39.2 C40.2 C41.1 C42.1 C43.2 C44.2 CN1.1 D4.1 D5.1 D6.1 D8.2(A) GND1.1 LED1.2(GND) LED2.2(GND) LED3.2(GND) LED4.2(GND) LED6.2(GND) LED7.2(GND) LED8.2(GND) LED9.2(GND) LED10.2(GND) LED11.2(GND) LED12.2(GND) LED13.2(GND) LED14.2(GND) LED15.2(GND) LED16.1(K) LED17.2(GND) LED18.2(GND) LED19.2(GND) LED21.1(K) R14.1 R19.1 R20.1 R27.2 R28.2 R30.2 R32.2 SW1.1 SW2.1 U1.2(GND) U3.2(VSS) U4.1(GND) U4.6(MODE) U5.1(GND) U5.2(GND) U5.42(GND) U5.43(GND) U5.46(GND) U5.47(GND) U5.48(GND) U5.49(GND) U5.50(GND) U5.51(GND) U5.52(GND) U5.53(GND) U5.54(GND) U5.55(GND) U5.56(GND) U5.57(GND) U5.58(GND) U5.59(GND) U5.60(GND) U5.GND U6.3(GND) U7.3(GND) U7.11(GND) U7.15(GND) U7.17(EP) U8.3(GND) U9.1(CTG) U9.4(GND) U9.6(QSTRT) U10.2(VSS) U12.4(GND) U12.9(EP)
VBAT: C8.1 CN1.2 Q1.3(D) TP8.1 TP11.1 U3.3(VBAT) U9.2(CELL)
VBUS: C9.1 C41.2 D1.2(A) D7.1(K) D8.1(C) LED5.2(A) Q1.1(G) R30.1 TP7.1 U3.4(VDD)
BM_ALRT: U5.29(IO34) U9.5(ALRT#)
BOOT: C43.1 SW2.2 TP4.1 U5.4(IO0)
CC1: R20.2
CC2: R19.2
D+: D4.2 U5.24(IO20)
D-: D5.2 U5.23(IO19)
DIN_LED: LED19.3(DI) U6.4(Y)
LED_BUF: U5.16(IO12) U6.2(A)
LED_STATUS: R40.1 U5.17(IO13)
MIC_CLK: U5.20(IO16) U7.16(BCLK) U8.4(CLOCK)
MIC_DATA: U5.19(IO15) U8.1(DATA)
MIC_SELECT: U5.21(IO17) U7.14(LRCLK) U8.2(SELECT)
MISO: U5.25(IO21) U12.2(SO/SIO1)
MOSI: U5.15(IO11) U12.5(SI/SIO0)
RESET: C15.1 C42.2 R21.1 SW1.2 TP5.1 U5.45(EN)
RX: TP3.1 U5.39(TXD0)
SCL: R18.1 U5.31(IO35) U9.7(SCL)
SD_CS: U5.10(IO6) U12.1(CS#)
SD_SCK: U5.22(IO18) U12.6(SCLK)
SDA: R17.1 U5.32(IO36) U9.8(SDA)
SLC_VCC: C3.1 C10.2 D1.1(K) L2.2 Q1.2(S) TP6.1 U1.1(EN) U1.4(IN) U4.5(EN) U4.7(VIN)
SPKR_DIN: U5.18(IO14) U7.1(DIN)
TOUCH_EXTERNAL: U5.28(IO33) U10.1(OUT)
TOUCH_EXTERNAL_PIN: H2.1 R24.2
TX: TP10.1 U5.40(RXD0)
$1N5324: C18.1 U10.4(SNS)
$1N5325: C18.2 R24.1 U10.3(SNSK)
$1N5342: R35.2 U7.4(SD_MODE#)
$1N5353: C24.2 H1.2 U7.10(OUTN)
$1N5354: C25.2 H1.1 U7.9(OUTP)
$1N5410: R28.1 U3.5(PROG)
$1N5412: LED5.1(K) R38.1
$1N5413: R38.2 U3.1(STAT)
$1N5423: L1.2 U1.3(LX)
$1N5430: L2.1 U4.2(SW)
$1N5433: R13.1 R14.2 U4.4(FB)
$1N5458: LED18.3(DI) LED19.1(DO)
$1N5459: LED17.3(DI) LED18.1(DO)
$1N5464: LED15.3(DI) LED17.1(DO)
$1N5465: LED14.3(DI) LED15.1(DO)
$1N5470: LED13.3(DI) LED14.1(DO)
$1N5471: LED12.3(DI) LED13.1(DO)
$1N5476: LED11.3(DI) LED12.1(DO)
$1N5477: LED10.3(DI) LED11.1(DO)
$1N5482: LED9.3(DI) LED10.1(DO)
$1N5483: LED8.3(DI) LED9.1(DO)
$1N5488: LED7.3(DI) LED8.1(DO)
$1N5489: LED6.3(DI) LED7.1(DO)
$1N5494: LED4.3(DI) LED6.1(DO)
$1N5495: LED3.3(DI) LED4.1(DO)
$1N5500: LED2.3(DI) LED3.1(DO)
$1N5501: LED1.3(DI) LED2.1(DO)
$1N5535: DO1.1 LED1.1(DO)
$1N5564: C2.1 R2.1 R32.1 U1.5(FB)
$1N19227: LED21.2(A) R39.2
$1N19266: LED16.2(A) R40.2
$1N28187: R41.2 U12.7(HOLD#/SIO3)
$1N31093: R42.2 U12.3(WP#/SIO2)
Net-(D6-2): D6.2 D7.2(A)

Not connected (* = marked no-connect by the designer): U5 5(IO1)* 6(IO2)* 7(IO3)* 8(IO4)* 9(IO5)* 11(IO7)* 12(IO8)* 13(IO9)* 14(IO10)* 26(IO26)* 27(IO47)* 30(IO48)* 33(IO37)* 34(IO38)* 35(IO39)* 36(IO40)* 37(IO41)* 38(IO42)* 41(IO45)* 44(IO46)*; U6 1(NC)*; U7 5(N.C.)* 6(N.C.)* 12(N.C.)* 13(N.C.)*; USB1 1(EH) A1(GND) A4(VBUS) A5(CC1) A6(DP1) A7(DN1) A8(SBU1)* A9(VBUS) A12(GND) B1(GND) B4(VBUS) B5(CC2) B6(DP2) B7(DN2) B8(SBU2)* B9(VBUS) B12(GND)

## Notes on the sheet
- BB 3V3
- OR
- Status LED
- BB 5V
- Charger
- CHANGE
- USB C
- ESP32-S3-MINI_N4R2
- strap
- strap
- strap
- RESET
- strap
- NC
- BOOT
- Status LED
- SPEAKER
- MIC
- BATTERY STATUS
- TOUCH SENSOR
- External flash
- NC
